# Altium schematic sheet FLAT_LED.SchDoc
size A2
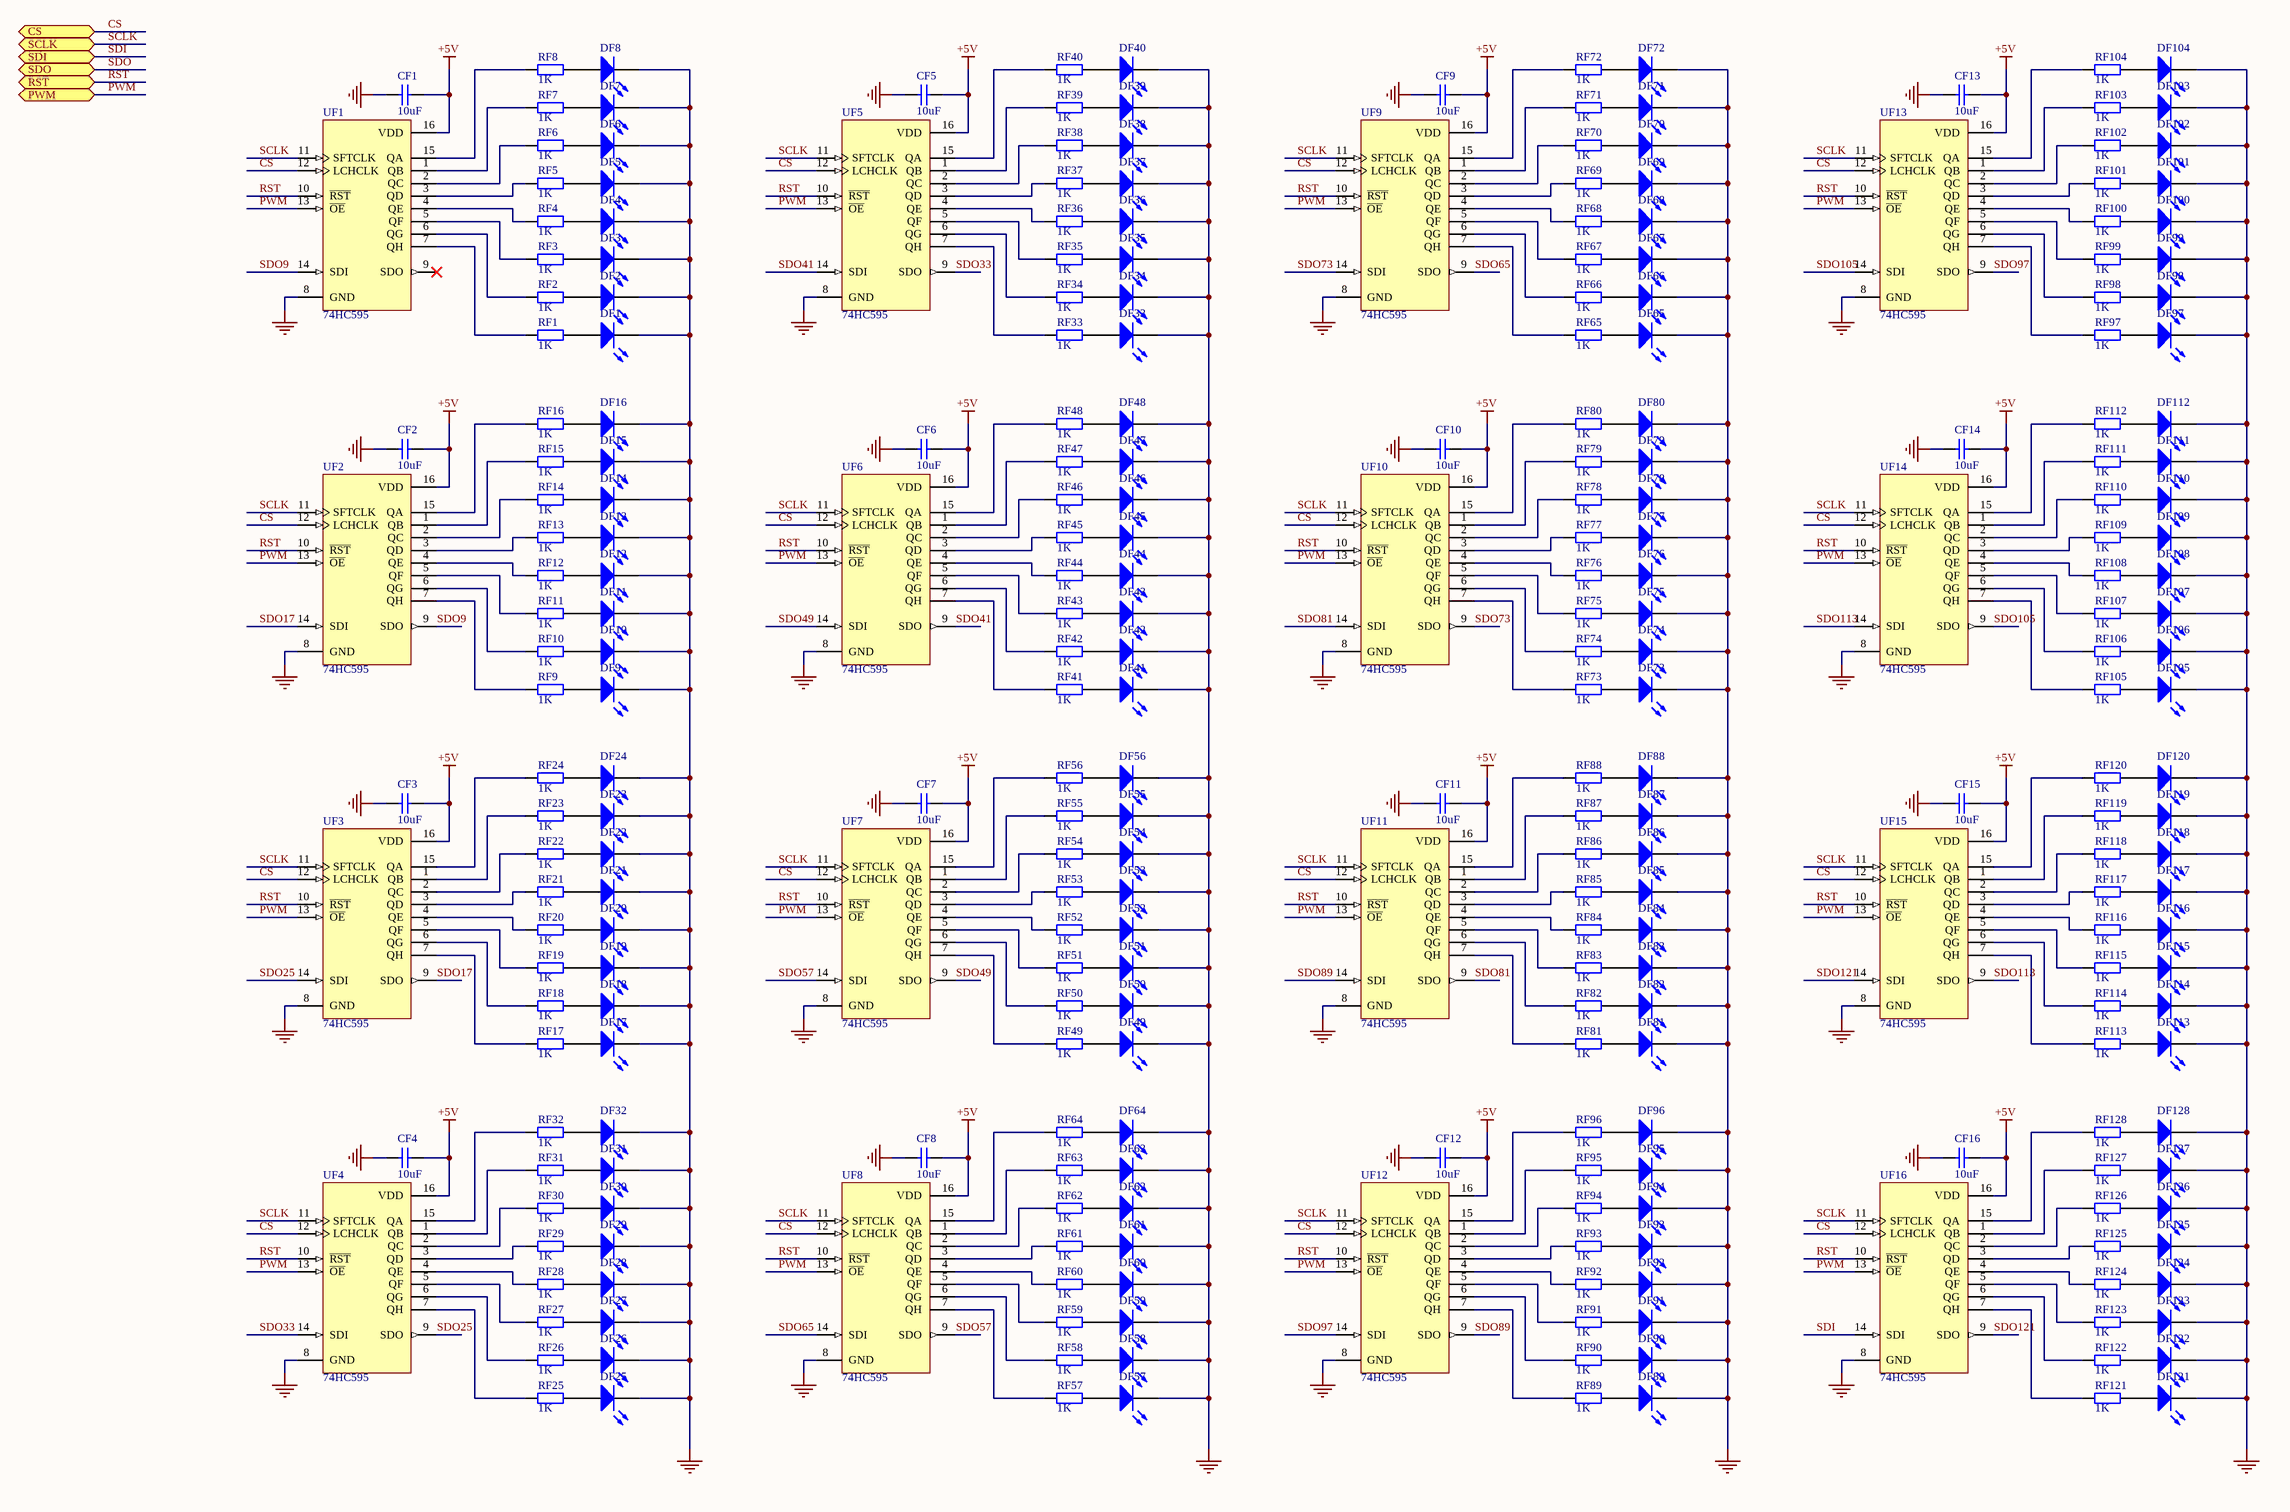
[diagram p0: FLAT_LED.SchDoc]

## Parts
CF1  value 10uF  [CAPC1608N]  (hidden comment: Cap1)
CF2  value 10uF  [CAPC1608N]  (hidden comment: Cap1)
CF3  value 10uF  [CAPC1608N]  (hidden comment: Cap1)
CF4  value 10uF  [CAPC1608N]  (hidden comment: Cap1)
CF5  value 10uF  [CAPC1608N]  (hidden comment: Cap1)
CF6  value 10uF  [CAPC1608N]  (hidden comment: Cap1)
CF7  value 10uF  [CAPC1608N]  (hidden comment: Cap1)
CF8  value 10uF  [CAPC1608N]  (hidden comment: Cap1)
CF9  value 10uF  [CAPC1608N]  (hidden comment: Cap1)
CF10  value 10uF  [CAPC1608N]  (hidden comment: Cap1)
CF11  value 10uF  [CAPC1608N]  (hidden comment: Cap1)
CF12  value 10uF  [CAPC1608N]  (hidden comment: Cap1)
CF13  value 10uF  [CAPC1608N]  (hidden comment: Cap1)
CF14  value 10uF  [CAPC1608N]  (hidden comment: Cap1)
CF15  value 10uF  [CAPC1608N]  (hidden comment: Cap1)
CF16  value 10uF  [CAPC1608N]  (hidden comment: Cap1)
DF1  (no value)  [CD1005-0402-L]
DF2  (no value)  [CD1005-0402-L]
DF3  (no value)  [CD1005-0402-L]
DF4  (no value)  [CD1005-0402-L]
DF5  (no value)  [CD1005-0402-L]
DF6  (no value)  [CD1005-0402-L]
DF7  (no value)  [CD1005-0402-L]
DF8  (no value)  [CD1005-0402-L]
DF9  (no value)  [CD1005-0402-L]
DF10  (no value)  [CD1005-0402-L]
DF11  (no value)  [CD1005-0402-L]
DF12  (no value)  [CD1005-0402-L]
DF13  (no value)  [CD1005-0402-L]
DF14  (no value)  [CD1005-0402-L]
DF15  (no value)  [CD1005-0402-L]
DF16  (no value)  [CD1005-0402-L]
DF17  (no value)  [CD1005-0402-L]
DF18  (no value)  [CD1005-0402-L]
DF19  (no value)  [CD1005-0402-L]
DF20  (no value)  [CD1005-0402-L]
DF21  (no value)  [CD1005-0402-L]
DF22  (no value)  [CD1005-0402-L]
DF23  (no value)  [CD1005-0402-L]
DF24  (no value)  [CD1005-0402-L]
DF25  (no value)  [CD1005-0402-L]
DF26  (no value)  [CD1005-0402-L]
DF27  (no value)  [CD1005-0402-L]
DF28  (no value)  [CD1005-0402-L]
DF29  (no value)  [CD1005-0402-L]
DF30  (no value)  [CD1005-0402-L]
DF31  (no value)  [CD1005-0402-L]
DF32  (no value)  [CD1005-0402-L]
DF33  (no value)  [CD1005-0402-L]
DF34  (no value)  [CD1005-0402-L]
DF35  (no value)  [CD1005-0402-L]
DF36  (no value)  [CD1005-0402-L]
DF37  (no value)  [CD1005-0402-L]
DF38  (no value)  [CD1005-0402-L]
DF39  (no value)  [CD1005-0402-L]
DF40  (no value)  [CD1005-0402-L]
DF41  (no value)  [CD1005-0402-L]
DF42  (no value)  [CD1005-0402-L]
DF43  (no value)  [CD1005-0402-L]
DF44  (no value)  [CD1005-0402-L]
DF45  (no value)  [CD1005-0402-L]
DF46  (no value)  [CD1005-0402-L]
DF47  (no value)  [CD1005-0402-L]
DF48  (no value)  [CD1005-0402-L]
DF49  (no value)  [CD1005-0402-L]
DF50  (no value)  [CD1005-0402-L]
DF51  (no value)  [CD1005-0402-L]
DF52  (no value)  [CD1005-0402-L]
DF53  (no value)  [CD1005-0402-L]
DF54  (no value)  [CD1005-0402-L]
DF55  (no value)  [CD1005-0402-L]
DF56  (no value)  [CD1005-0402-L]
DF57  (no value)  [CD1005-0402-L]
DF58  (no value)  [CD1005-0402-L]
DF59  (no value)  [CD1005-0402-L]
DF60  (no value)  [CD1005-0402-L]
DF61  (no value)  [CD1005-0402-L]
DF62  (no value)  [CD1005-0402-L]
DF63  (no value)  [CD1005-0402-L]
DF64  (no value)  [CD1005-0402-L]
DF65  (no value)  [CD1005-0402-L]
DF66  (no value)  [CD1005-0402-L]
DF67  (no value)  [CD1005-0402-L]
DF68  (no value)  [CD1005-0402-L]
DF69  (no value)  [CD1005-0402-L]
DF70  (no value)  [CD1005-0402-L]
DF71  (no value)  [CD1005-0402-L]
DF72  (no value)  [CD1005-0402-L]
DF73  (no value)  [CD1005-0402-L]
DF74  (no value)  [CD1005-0402-L]
DF75  (no value)  [CD1005-0402-L]
DF76  (no value)  [CD1005-0402-L]
DF77  (no value)  [CD1005-0402-L]
DF78  (no value)  [CD1005-0402-L]
DF79  (no value)  [CD1005-0402-L]
DF80  (no value)  [CD1005-0402-L]
DF81  (no value)  [CD1005-0402-L]
DF82  (no value)  [CD1005-0402-L]
DF83  (no value)  [CD1005-0402-L]
DF84  (no value)  [CD1005-0402-L]
DF85  (no value)  [CD1005-0402-L]
DF86  (no value)  [CD1005-0402-L]
DF87  (no value)  [CD1005-0402-L]
DF88  (no value)  [CD1005-0402-L]
DF89  (no value)  [CD1005-0402-L]
DF90  (no value)  [CD1005-0402-L]
DF91  (no value)  [CD1005-0402-L]
DF92  (no value)  [CD1005-0402-L]
DF93  (no value)  [CD1005-0402-L]
DF94  (no value)  [CD1005-0402-L]
DF95  (no value)  [CD1005-0402-L]
DF96  (no value)  [CD1005-0402-L]
DF97  (no value)  [CD1005-0402-L]
DF98  (no value)  [CD1005-0402-L]
DF99  (no value)  [CD1005-0402-L]
DF100  (no value)  [CD1005-0402-L]
DF101  (no value)  [CD1005-0402-L]
DF102  (no value)  [CD1005-0402-L]
DF103  (no value)  [CD1005-0402-L]
DF104  (no value)  [CD1005-0402-L]
DF105  (no value)  [CD1005-0402-L]
DF106  (no value)  [CD1005-0402-L]
DF107  (no value)  [CD1005-0402-L]
DF108  (no value)  [CD1005-0402-L]
DF109  (no value)  [CD1005-0402-L]
DF110  (no value)  [CD1005-0402-L]
DF111  (no value)  [CD1005-0402-L]
DF112  (no value)  [CD1005-0402-L]
DF113  (no value)  [CD1005-0402-L]
DF114  (no value)  [CD1005-0402-L]
DF115  (no value)  [CD1005-0402-L]
DF116  (no value)  [CD1005-0402-L]
DF117  (no value)  [CD1005-0402-L]
DF118  (no value)  [CD1005-0402-L]
DF119  (no value)  [CD1005-0402-L]
DF120  (no value)  [CD1005-0402-L]
DF121  (no value)  [CD1005-0402-L]
DF122  (no value)  [CD1005-0402-L]
DF123  (no value)  [CD1005-0402-L]
DF124  (no value)  [CD1005-0402-L]
DF125  (no value)  [CD1005-0402-L]
DF126  (no value)  [CD1005-0402-L]
DF127  (no value)  [CD1005-0402-L]
DF128  (no value)  [CD1005-0402-L]
RF1  value 1K  [RESC1005L-0.5]  (hidden comment: Res1)
RF2  value 1K  [RESC1005L-0.5]  (hidden comment: Res1)
RF3  value 1K  [RESC1005L-0.5]  (hidden comment: Res1)
RF4  value 1K  [RESC1005L-0.5]  (hidden comment: Res1)
RF5  value 1K  [RESC1005L-0.5]  (hidden comment: Res1)
RF6  value 1K  [RESC1005L-0.5]  (hidden comment: Res1)
RF7  value 1K  [RESC1005L-0.5]  (hidden comment: Res1)
RF8  value 1K  [RESC1005L-0.5]  (hidden comment: Res1)
RF9  value 1K  [RESC1005L-0.5]  (hidden comment: Res1)
RF10  value 1K  [RESC1005L-0.5]  (hidden comment: Res1)
RF11  value 1K  [RESC1005L-0.5]  (hidden comment: Res1)
RF12  value 1K  [RESC1005L-0.5]  (hidden comment: Res1)
RF13  value 1K  [RESC1005L-0.5]  (hidden comment: Res1)
RF14  value 1K  [RESC1005L-0.5]  (hidden comment: Res1)
RF15  value 1K  [RESC1005L-0.5]  (hidden comment: Res1)
RF16  value 1K  [RESC1005L-0.5]  (hidden comment: Res1)
RF17  value 1K  [RESC1005L-0.5]  (hidden comment: Res1)
RF18  value 1K  [RESC1005L-0.5]  (hidden comment: Res1)
RF19  value 1K  [RESC1005L-0.5]  (hidden comment: Res1)
RF20  value 1K  [RESC1005L-0.5]  (hidden comment: Res1)
RF21  value 1K  [RESC1005L-0.5]  (hidden comment: Res1)
RF22  value 1K  [RESC1005L-0.5]  (hidden comment: Res1)
RF23  value 1K  [RESC1005L-0.5]  (hidden comment: Res1)
RF24  value 1K  [RESC1005L-0.5]  (hidden comment: Res1)
RF25  value 1K  [RESC1005L-0.5]  (hidden comment: Res1)
RF26  value 1K  [RESC1005L-0.5]  (hidden comment: Res1)
RF27  value 1K  [RESC1005L-0.5]  (hidden comment: Res1)
RF28  value 1K  [RESC1005L-0.5]  (hidden comment: Res1)
RF29  value 1K  [RESC1005L-0.5]  (hidden comment: Res1)
RF30  value 1K  [RESC1005L-0.5]  (hidden comment: Res1)
RF31  value 1K  [RESC1005L-0.5]  (hidden comment: Res1)
RF32  value 1K  [RESC1005L-0.5]  (hidden comment: Res1)
RF33  value 1K  [RESC1005L-0.5]  (hidden comment: Res1)
RF34  value 1K  [RESC1005L-0.5]  (hidden comment: Res1)
RF35  value 1K  [RESC1005L-0.5]  (hidden comment: Res1)
RF36  value 1K  [RESC1005L-0.5]  (hidden comment: Res1)
RF37  value 1K  [RESC1005L-0.5]  (hidden comment: Res1)
RF38  value 1K  [RESC1005L-0.5]  (hidden comment: Res1)
RF39  value 1K  [RESC1005L-0.5]  (hidden comment: Res1)
RF40  value 1K  [RESC1005L-0.5]  (hidden comment: Res1)
RF41  value 1K  [RESC1005L-0.5]  (hidden comment: Res1)
RF42  value 1K  [RESC1005L-0.5]  (hidden comment: Res1)
RF43  value 1K  [RESC1005L-0.5]  (hidden comment: Res1)
RF44  value 1K  [RESC1005L-0.5]  (hidden comment: Res1)
RF45  value 1K  [RESC1005L-0.5]  (hidden comment: Res1)
RF46  value 1K  [RESC1005L-0.5]  (hidden comment: Res1)
RF47  value 1K  [RESC1005L-0.5]  (hidden comment: Res1)
RF48  value 1K  [RESC1005L-0.5]  (hidden comment: Res1)
RF49  value 1K  [RESC1005L-0.5]  (hidden comment: Res1)
RF50  value 1K  [RESC1005L-0.5]  (hidden comment: Res1)
RF51  value 1K  [RESC1005L-0.5]  (hidden comment: Res1)
RF52  value 1K  [RESC1005L-0.5]  (hidden comment: Res1)
RF53  value 1K  [RESC1005L-0.5]  (hidden comment: Res1)
RF54  value 1K  [RESC1005L-0.5]  (hidden comment: Res1)
RF55  value 1K  [RESC1005L-0.5]  (hidden comment: Res1)
RF56  value 1K  [RESC1005L-0.5]  (hidden comment: Res1)
RF57  value 1K  [RESC1005L-0.5]  (hidden comment: Res1)
RF58  value 1K  [RESC1005L-0.5]  (hidden comment: Res1)
RF59  value 1K  [RESC1005L-0.5]  (hidden comment: Res1)
RF60  value 1K  [RESC1005L-0.5]  (hidden comment: Res1)
RF61  value 1K  [RESC1005L-0.5]  (hidden comment: Res1)
RF62  value 1K  [RESC1005L-0.5]  (hidden comment: Res1)
RF63  value 1K  [RESC1005L-0.5]  (hidden comment: Res1)
RF64  value 1K  [RESC1005L-0.5]  (hidden comment: Res1)
RF65  value 1K  [RESC1005L-0.5]  (hidden comment: Res1)
RF66  value 1K  [RESC1005L-0.5]  (hidden comment: Res1)
RF67  value 1K  [RESC1005L-0.5]  (hidden comment: Res1)
RF68  value 1K  [RESC1005L-0.5]  (hidden comment: Res1)
RF69  value 1K  [RESC1005L-0.5]  (hidden comment: Res1)
RF70  value 1K  [RESC1005L-0.5]  (hidden comment: Res1)
RF71  value 1K  [RESC1005L-0.5]  (hidden comment: Res1)
RF72  value 1K  [RESC1005L-0.5]  (hidden comment: Res1)
RF73  value 1K  [RESC1005L-0.5]  (hidden comment: Res1)
RF74  value 1K  [RESC1005L-0.5]  (hidden comment: Res1)
RF75  value 1K  [RESC1005L-0.5]  (hidden comment: Res1)
RF76  value 1K  [RESC1005L-0.5]  (hidden comment: Res1)
RF77  value 1K  [RESC1005L-0.5]  (hidden comment: Res1)
RF78  value 1K  [RESC1005L-0.5]  (hidden comment: Res1)
RF79  value 1K  [RESC1005L-0.5]  (hidden comment: Res1)
RF80  value 1K  [RESC1005L-0.5]  (hidden comment: Res1)
RF81  value 1K  [RESC1005L-0.5]  (hidden comment: Res1)
RF82  value 1K  [RESC1005L-0.5]  (hidden comment: Res1)
RF83  value 1K  [RESC1005L-0.5]  (hidden comment: Res1)
RF84  value 1K  [RESC1005L-0.5]  (hidden comment: Res1)
RF85  value 1K  [RESC1005L-0.5]  (hidden comment: Res1)
RF86  value 1K  [RESC1005L-0.5]  (hidden comment: Res1)
RF87  value 1K  [RESC1005L-0.5]  (hidden comment: Res1)
RF88  value 1K  [RESC1005L-0.5]  (hidden comment: Res1)
RF89  value 1K  [RESC1005L-0.5]  (hidden comment: Res1)
RF90  value 1K  [RESC1005L-0.5]  (hidden comment: Res1)
RF91  value 1K  [RESC1005L-0.5]  (hidden comment: Res1)
RF92  value 1K  [RESC1005L-0.5]  (hidden comment: Res1)
RF93  value 1K  [RESC1005L-0.5]  (hidden comment: Res1)
RF94  value 1K  [RESC1005L-0.5]  (hidden comment: Res1)
RF95  value 1K  [RESC1005L-0.5]  (hidden comment: Res1)
RF96  value 1K  [RESC1005L-0.5]  (hidden comment: Res1)
RF97  value 1K  [RESC1005L-0.5]  (hidden comment: Res1)
RF98  value 1K  [RESC1005L-0.5]  (hidden comment: Res1)
RF99  value 1K  [RESC1005L-0.5]  (hidden comment: Res1)
RF100  value 1K  [RESC1005L-0.5]  (hidden comment: Res1)
RF101  value 1K  [RESC1005L-0.5]  (hidden comment: Res1)
RF102  value 1K  [RESC1005L-0.5]  (hidden comment: Res1)
RF103  value 1K  [RESC1005L-0.5]  (hidden comment: Res1)
RF104  value 1K  [RESC1005L-0.5]  (hidden comment: Res1)
RF105  value 1K  [RESC1005L-0.5]  (hidden comment: Res1)
RF106  value 1K  [RESC1005L-0.5]  (hidden comment: Res1)
RF107  value 1K  [RESC1005L-0.5]  (hidden comment: Res1)
RF108  value 1K  [RESC1005L-0.5]  (hidden comment: Res1)
RF109  value 1K  [RESC1005L-0.5]  (hidden comment: Res1)
RF110  value 1K  [RESC1005L-0.5]  (hidden comment: Res1)
RF111  value 1K  [RESC1005L-0.5]  (hidden comment: Res1)
RF112  value 1K  [RESC1005L-0.5]  (hidden comment: Res1)
RF113  value 1K  [RESC1005L-0.5]  (hidden comment: Res1)
RF114  value 1K  [RESC1005L-0.5]  (hidden comment: Res1)
RF115  value 1K  [RESC1005L-0.5]  (hidden comment: Res1)
RF116  value 1K  [RESC1005L-0.5]  (hidden comment: Res1)
RF117  value 1K  [RESC1005L-0.5]  (hidden comment: Res1)
RF118  value 1K  [RESC1005L-0.5]  (hidden comment: Res1)
RF119  value 1K  [RESC1005L-0.5]  (hidden comment: Res1)
RF120  value 1K  [RESC1005L-0.5]  (hidden comment: Res1)
RF121  value 1K  [RESC1005L-0.5]  (hidden comment: Res1)
RF122  value 1K  [RESC1005L-0.5]  (hidden comment: Res1)
RF123  value 1K  [RESC1005L-0.5]  (hidden comment: Res1)
RF124  value 1K  [RESC1005L-0.5]  (hidden comment: Res1)
RF125  value 1K  [RESC1005L-0.5]  (hidden comment: Res1)
RF126  value 1K  [RESC1005L-0.5]  (hidden comment: Res1)
RF127  value 1K  [RESC1005L-0.5]  (hidden comment: Res1)
RF128  value 1K  [RESC1005L-0.5]  (hidden comment: Res1)
UF1  74HC595  [TSSOP-16N]
UF2  74HC595  [TSSOP-16N]
UF3  74HC595  [TSSOP-16N]
UF4  74HC595  [TSSOP-16N]
UF5  74HC595  [TSSOP-16N]
UF6  74HC595  [TSSOP-16N]
UF7  74HC595  [TSSOP-16N]
UF8  74HC595  [TSSOP-16N]
UF9  74HC595  [TSSOP-16N]
UF10  74HC595  [TSSOP-16N]
UF11  74HC595  [TSSOP-16N]
UF12  74HC595  [TSSOP-16N]
UF13  74HC595  [TSSOP-16N]
UF14  74HC595  [TSSOP-16N]
UF15  74HC595  [TSSOP-16N]
UF16  74HC595  [TSSOP-16N]

## Ports
CS, PWM, RST, SCLK, SDI, SDO

## Nets
+5V: CF1.2 CF2.2 CF3.2 CF4.2 CF5.2 CF6.2 CF7.2 CF8.2 CF9.2 CF10.2 CF11.2 CF12.2 CF13.2 CF14.2 CF15.2 CF16.2 UF1.16(VDD) UF2.16(VDD) UF3.16(VDD) UF4.16(VDD) UF5.16(VDD) UF6.16(VDD) UF7.16(VDD) UF8.16(VDD) UF9.16(VDD) UF10.16(VDD) UF11.16(VDD) UF12.16(VDD) UF13.16(VDD) UF14.16(VDD) UF15.16(VDD) UF16.16(VDD)
GND: CF1.1 CF2.1 CF3.1 CF4.1 CF5.1 CF6.1 CF7.1 CF8.1 CF9.1 CF10.1 CF11.1 CF12.1 CF13.1 CF14.1 CF15.1 CF16.1 DF1.2(K) DF2.2(K) DF3.2(K) DF4.2(K) DF5.2(K) DF6.2(K) DF7.2(K) DF8.2(K) DF9.2(K) DF10.2(K) DF11.2(K) DF12.2(K) DF13.2(K) DF14.2(K) DF15.2(K) DF16.2(K) DF17.2(K) DF18.2(K) DF19.2(K) DF20.2(K) DF21.2(K) DF22.2(K) DF23.2(K) DF24.2(K) DF25.2(K) DF26.2(K) DF27.2(K) DF28.2(K) DF29.2(K) DF30.2(K) DF31.2(K) DF32.2(K) DF33.2(K) DF34.2(K) DF35.2(K) DF36.2(K) DF37.2(K) DF38.2(K) DF39.2(K) DF40.2(K) DF41.2(K) DF42.2(K) DF43.2(K) DF44.2(K) DF45.2(K) DF46.2(K) DF47.2(K) DF48.2(K) DF49.2(K) DF50.2(K) DF51.2(K) DF52.2(K) DF53.2(K) DF54.2(K) DF55.2(K) DF56.2(K) DF57.2(K) DF58.2(K) DF59.2(K) DF60.2(K) DF61.2(K) DF62.2(K) DF63.2(K) DF64.2(K) DF65.2(K) DF66.2(K) DF67.2(K) DF68.2(K) DF69.2(K) DF70.2(K) DF71.2(K) DF72.2(K) DF73.2(K) DF74.2(K) DF75.2(K) DF76.2(K) DF77.2(K) DF78.2(K) DF79.2(K) DF80.2(K) DF81.2(K) DF82.2(K) DF83.2(K) DF84.2(K) DF85.2(K) DF86.2(K) DF87.2(K) DF88.2(K) DF89.2(K) DF90.2(K) DF91.2(K) DF92.2(K) DF93.2(K) DF94.2(K) DF95.2(K) DF96.2(K) DF97.2(K) DF98.2(K) DF99.2(K) DF100.2(K) DF101.2(K) DF102.2(K) DF103.2(K) DF104.2(K) DF105.2(K) DF106.2(K) DF107.2(K) DF108.2(K) DF109.2(K) DF110.2(K) DF111.2(K) DF112.2(K) DF113.2(K) DF114.2(K) DF115.2(K) DF116.2(K) DF117.2(K) DF118.2(K) DF119.2(K) DF120.2(K) DF121.2(K) DF122.2(K) DF123.2(K) DF124.2(K) DF125.2(K) DF126.2(K) DF127.2(K) DF128.2(K) UF1.8(GND) UF2.8(GND) UF3.8(GND) UF4.8(GND) UF5.8(GND) UF6.8(GND) UF7.8(GND) UF8.8(GND) UF9.8(GND) UF10.8(GND) UF11.8(GND) UF12.8(GND) UF13.8(GND) UF14.8(GND) UF15.8(GND) UF16.8(GND)
CS: UF1.12(LCHCLK) UF2.12(LCHCLK) UF3.12(LCHCLK) UF4.12(LCHCLK) UF5.12(LCHCLK) UF6.12(LCHCLK) UF7.12(LCHCLK) UF8.12(LCHCLK) UF9.12(LCHCLK) UF10.12(LCHCLK) UF11.12(LCHCLK) UF12.12(LCHCLK) UF13.12(LCHCLK) UF14.12(LCHCLK) UF15.12(LCHCLK) UF16.12(LCHCLK) ; port CS
PWM: UF1.13(~{OE}) UF2.13(~{OE}) UF3.13(~{OE}) UF4.13(~{OE}) UF5.13(~{OE}) UF6.13(~{OE}) UF7.13(~{OE}) UF8.13(~{OE}) UF9.13(~{OE}) UF10.13(~{OE}) UF11.13(~{OE}) UF12.13(~{OE}) UF13.13(~{OE}) UF14.13(~{OE}) UF15.13(~{OE}) UF16.13(~{OE}) ; port PWM
RST: UF1.10(~{RST}) UF2.10(~{RST}) UF3.10(~{RST}) UF4.10(~{RST}) UF5.10(~{RST}) UF6.10(~{RST}) UF7.10(~{RST}) UF8.10(~{RST}) UF9.10(~{RST}) UF10.10(~{RST}) UF11.10(~{RST}) UF12.10(~{RST}) UF13.10(~{RST}) UF14.10(~{RST}) UF15.10(~{RST}) UF16.10(~{RST}) ; port RST
SCLK: UF1.11(SFTCLK) UF2.11(SFTCLK) UF3.11(SFTCLK) UF4.11(SFTCLK) UF5.11(SFTCLK) UF6.11(SFTCLK) UF7.11(SFTCLK) UF8.11(SFTCLK) UF9.11(SFTCLK) UF10.11(SFTCLK) UF11.11(SFTCLK) UF12.11(SFTCLK) UF13.11(SFTCLK) UF14.11(SFTCLK) UF15.11(SFTCLK) UF16.11(SFTCLK) ; port SCLK
SDI: UF16.14(SDI) ; port SDI
SDO: port SDO
SDO9: UF1.14(SDI) UF2.9(SDO)
SDO17: UF2.14(SDI) UF3.9(SDO)
SDO25: UF3.14(SDI) UF4.9(SDO)
SDO33: UF4.14(SDI) UF5.9(SDO)
SDO41: UF5.14(SDI) UF6.9(SDO)
SDO49: UF6.14(SDI) UF7.9(SDO)
SDO57: UF7.14(SDI) UF8.9(SDO)
SDO65: UF8.14(SDI) UF9.9(SDO)
SDO73: UF9.14(SDI) UF10.9(SDO)
SDO81: UF10.14(SDI) UF11.9(SDO)
SDO89: UF11.14(SDI) UF12.9(SDO)
SDO97: UF12.14(SDI) UF13.9(SDO)
SDO105: UF13.14(SDI) UF14.9(SDO)
SDO113: UF14.14(SDI) UF15.9(SDO)
SDO121: UF15.14(SDI) UF16.9(SDO)
NetDF1_1: DF1.1(A) RF1.2
NetDF2_1: DF2.1(A) RF2.2
NetDF3_1: DF3.1(A) RF3.2
NetDF4_1: DF4.1(A) RF4.2
NetDF5_1: DF5.1(A) RF5.2
NetDF6_1: DF6.1(A) RF6.2
NetDF7_1: DF7.1(A) RF7.2
NetDF8_1: DF8.1(A) RF8.2
NetDF9_1: DF9.1(A) RF9.2
NetDF10_1: DF10.1(A) RF10.2
NetDF11_1: DF11.1(A) RF11.2
NetDF12_1: DF12.1(A) RF12.2
NetDF13_1: DF13.1(A) RF13.2
NetDF14_1: DF14.1(A) RF14.2
NetDF15_1: DF15.1(A) RF15.2
NetDF16_1: DF16.1(A) RF16.2
NetDF17_1: DF17.1(A) RF17.2
NetDF18_1: DF18.1(A) RF18.2
NetDF19_1: DF19.1(A) RF19.2
NetDF20_1: DF20.1(A) RF20.2
NetDF21_1: DF21.1(A) RF21.2
NetDF22_1: DF22.1(A) RF22.2
NetDF23_1: DF23.1(A) RF23.2
NetDF24_1: DF24.1(A) RF24.2
NetDF25_1: DF25.1(A) RF25.2
NetDF26_1: DF26.1(A) RF26.2
NetDF27_1: DF27.1(A) RF27.2
NetDF28_1: DF28.1(A) RF28.2
NetDF29_1: DF29.1(A) RF29.2
NetDF30_1: DF30.1(A) RF30.2
NetDF31_1: DF31.1(A) RF31.2
NetDF32_1: DF32.1(A) RF32.2
NetDF33_1: DF33.1(A) RF33.2
NetDF34_1: DF34.1(A) RF34.2
NetDF35_1: DF35.1(A) RF35.2
NetDF36_1: DF36.1(A) RF36.2
NetDF37_1: DF37.1(A) RF37.2
NetDF38_1: DF38.1(A) RF38.2
NetDF39_1: DF39.1(A) RF39.2
NetDF40_1: DF40.1(A) RF40.2
NetDF41_1: DF41.1(A) RF41.2
NetDF42_1: DF42.1(A) RF42.2
NetDF43_1: DF43.1(A) RF43.2
NetDF44_1: DF44.1(A) RF44.2
NetDF45_1: DF45.1(A) RF45.2
NetDF46_1: DF46.1(A) RF46.2
NetDF47_1: DF47.1(A) RF47.2
NetDF48_1: DF48.1(A) RF48.2
NetDF49_1: DF49.1(A) RF49.2
NetDF50_1: DF50.1(A) RF50.2
NetDF51_1: DF51.1(A) RF51.2
NetDF52_1: DF52.1(A) RF52.2
NetDF53_1: DF53.1(A) RF53.2
NetDF54_1: DF54.1(A) RF54.2
NetDF55_1: DF55.1(A) RF55.2
NetDF56_1: DF56.1(A) RF56.2
NetDF57_1: DF57.1(A) RF57.2
NetDF58_1: DF58.1(A) RF58.2
NetDF59_1: DF59.1(A) RF59.2
NetDF60_1: DF60.1(A) RF60.2
NetDF61_1: DF61.1(A) RF61.2
NetDF62_1: DF62.1(A) RF62.2
NetDF63_1: DF63.1(A) RF63.2
NetDF64_1: DF64.1(A) RF64.2
NetDF65_1: DF65.1(A) RF65.2
NetDF66_1: DF66.1(A) RF66.2
NetDF67_1: DF67.1(A) RF67.2
NetDF68_1: DF68.1(A) RF68.2
NetDF69_1: DF69.1(A) RF69.2
NetDF70_1: DF70.1(A) RF70.2
NetDF71_1: DF71.1(A) RF71.2
NetDF72_1: DF72.1(A) RF72.2
NetDF73_1: DF73.1(A) RF73.2
NetDF74_1: DF74.1(A) RF74.2
NetDF75_1: DF75.1(A) RF75.2
NetDF76_1: DF76.1(A) RF76.2
NetDF77_1: DF77.1(A) RF77.2
NetDF78_1: DF78.1(A) RF78.2
NetDF79_1: DF79.1(A) RF79.2
NetDF80_1: DF80.1(A) RF80.2
NetDF81_1: DF81.1(A) RF81.2
NetDF82_1: DF82.1(A) RF82.2
NetDF83_1: DF83.1(A) RF83.2
NetDF84_1: DF84.1(A) RF84.2
NetDF85_1: DF85.1(A) RF85.2
NetDF86_1: DF86.1(A) RF86.2
NetDF87_1: DF87.1(A) RF87.2
NetDF88_1: DF88.1(A) RF88.2
NetDF89_1: DF89.1(A) RF89.2
NetDF90_1: DF90.1(A) RF90.2
NetDF91_1: DF91.1(A) RF91.2
NetDF92_1: DF92.1(A) RF92.2
NetDF93_1: DF93.1(A) RF93.2
NetDF94_1: DF94.1(A) RF94.2
NetDF95_1: DF95.1(A) RF95.2
NetDF96_1: DF96.1(A) RF96.2
NetDF97_1: DF97.1(A) RF97.2
NetDF98_1: DF98.1(A) RF98.2
NetDF99_1: DF99.1(A) RF99.2
NetDF100_1: DF100.1(A) RF100.2
NetDF101_1: DF101.1(A) RF101.2
NetDF102_1: DF102.1(A) RF102.2
NetDF103_1: DF103.1(A) RF103.2
NetDF104_1: DF104.1(A) RF104.2
NetDF105_1: DF105.1(A) RF105.2
NetDF106_1: DF106.1(A) RF106.2
NetDF107_1: DF107.1(A) RF107.2
NetDF108_1: DF108.1(A) RF108.2
NetDF109_1: DF109.1(A) RF109.2
NetDF110_1: DF110.1(A) RF110.2
NetDF111_1: DF111.1(A) RF111.2
NetDF112_1: DF112.1(A) RF112.2
NetDF113_1: DF113.1(A) RF113.2
NetDF114_1: DF114.1(A) RF114.2
NetDF115_1: DF115.1(A) RF115.2
NetDF116_1: DF116.1(A) RF116.2
NetDF117_1: DF117.1(A) RF117.2
NetDF118_1: DF118.1(A) RF118.2
NetDF119_1: DF119.1(A) RF119.2
NetDF120_1: DF120.1(A) RF120.2
NetDF121_1: DF121.1(A) RF121.2
NetDF122_1: DF122.1(A) RF122.2
NetDF123_1: DF123.1(A) RF123.2
NetDF124_1: DF124.1(A) RF124.2
NetDF125_1: DF125.1(A) RF125.2
NetDF126_1: DF126.1(A) RF126.2
NetDF127_1: DF127.1(A) RF127.2
NetDF128_1: DF128.1(A) RF128.2
NetRF1_1: RF1.1 UF1.7(QH)
NetRF2_1: RF2.1 UF1.6(QG)
NetRF3_1: RF3.1 UF1.5(QF)
NetRF4_1: RF4.1 UF1.4(QE)
NetRF5_1: RF5.1 UF1.3(QD)
NetRF6_1: RF6.1 UF1.2(QC)
NetRF7_1: RF7.1 UF1.1(QB)
NetRF8_1: RF8.1 UF1.15(QA)
NetRF9_1: RF9.1 UF2.7(QH)
NetRF10_1: RF10.1 UF2.6(QG)
NetRF11_1: RF11.1 UF2.5(QF)
NetRF12_1: RF12.1 UF2.4(QE)
NetRF13_1: RF13.1 UF2.3(QD)
NetRF14_1: RF14.1 UF2.2(QC)
NetRF15_1: RF15.1 UF2.1(QB)
NetRF16_1: RF16.1 UF2.15(QA)
NetRF17_1: RF17.1 UF3.7(QH)
NetRF18_1: RF18.1 UF3.6(QG)
NetRF19_1: RF19.1 UF3.5(QF)
NetRF20_1: RF20.1 UF3.4(QE)
NetRF21_1: RF21.1 UF3.3(QD)
NetRF22_1: RF22.1 UF3.2(QC)
NetRF23_1: RF23.1 UF3.1(QB)
NetRF24_1: RF24.1 UF3.15(QA)
NetRF25_1: RF25.1 UF4.7(QH)
NetRF26_1: RF26.1 UF4.6(QG)
NetRF27_1: RF27.1 UF4.5(QF)
NetRF28_1: RF28.1 UF4.4(QE)
NetRF29_1: RF29.1 UF4.3(QD)
NetRF30_1: RF30.1 UF4.2(QC)
NetRF31_1: RF31.1 UF4.1(QB)
NetRF32_1: RF32.1 UF4.15(QA)
NetRF33_1: RF33.1 UF5.7(QH)
NetRF34_1: RF34.1 UF5.6(QG)
NetRF35_1: RF35.1 UF5.5(QF)
NetRF36_1: RF36.1 UF5.4(QE)
NetRF37_1: RF37.1 UF5.3(QD)
NetRF38_1: RF38.1 UF5.2(QC)
NetRF39_1: RF39.1 UF5.1(QB)
NetRF40_1: RF40.1 UF5.15(QA)
NetRF41_1: RF41.1 UF6.7(QH)
NetRF42_1: RF42.1 UF6.6(QG)
NetRF43_1: RF43.1 UF6.5(QF)
NetRF44_1: RF44.1 UF6.4(QE)
NetRF45_1: RF45.1 UF6.3(QD)
NetRF46_1: RF46.1 UF6.2(QC)
NetRF47_1: RF47.1 UF6.1(QB)
NetRF48_1: RF48.1 UF6.15(QA)
NetRF49_1: RF49.1 UF7.7(QH)
NetRF50_1: RF50.1 UF7.6(QG)
NetRF51_1: RF51.1 UF7.5(QF)
NetRF52_1: RF52.1 UF7.4(QE)
NetRF53_1: RF53.1 UF7.3(QD)
NetRF54_1: RF54.1 UF7.2(QC)
NetRF55_1: RF55.1 UF7.1(QB)
NetRF56_1: RF56.1 UF7.15(QA)
NetRF57_1: RF57.1 UF8.7(QH)
NetRF58_1: RF58.1 UF8.6(QG)
NetRF59_1: RF59.1 UF8.5(QF)
NetRF60_1: RF60.1 UF8.4(QE)
NetRF61_1: RF61.1 UF8.3(QD)
NetRF62_1: RF62.1 UF8.2(QC)
NetRF63_1: RF63.1 UF8.1(QB)
NetRF64_1: RF64.1 UF8.15(QA)
NetRF65_1: RF65.1 UF9.7(QH)
NetRF66_1: RF66.1 UF9.6(QG)
NetRF67_1: RF67.1 UF9.5(QF)
NetRF68_1: RF68.1 UF9.4(QE)
NetRF69_1: RF69.1 UF9.3(QD)
NetRF70_1: RF70.1 UF9.2(QC)
NetRF71_1: RF71.1 UF9.1(QB)
NetRF72_1: RF72.1 UF9.15(QA)
NetRF73_1: RF73.1 UF10.7(QH)
NetRF74_1: RF74.1 UF10.6(QG)
NetRF75_1: RF75.1 UF10.5(QF)
NetRF76_1: RF76.1 UF10.4(QE)
NetRF77_1: RF77.1 UF10.3(QD)
NetRF78_1: RF78.1 UF10.2(QC)
NetRF79_1: RF79.1 UF10.1(QB)
NetRF80_1: RF80.1 UF10.15(QA)
NetRF81_1: RF81.1 UF11.7(QH)
NetRF82_1: RF82.1 UF11.6(QG)
NetRF83_1: RF83.1 UF11.5(QF)
NetRF84_1: RF84.1 UF11.4(QE)
NetRF85_1: RF85.1 UF11.3(QD)
NetRF86_1: RF86.1 UF11.2(QC)
NetRF87_1: RF87.1 UF11.1(QB)
NetRF88_1: RF88.1 UF11.15(QA)
NetRF89_1: RF89.1 UF12.7(QH)
NetRF90_1: RF90.1 UF12.6(QG)
NetRF91_1: RF91.1 UF12.5(QF)
NetRF92_1: RF92.1 UF12.4(QE)
NetRF93_1: RF93.1 UF12.3(QD)
NetRF94_1: RF94.1 UF12.2(QC)
NetRF95_1: RF95.1 UF12.1(QB)
NetRF96_1: RF96.1 UF12.15(QA)
NetRF97_1: RF97.1 UF13.7(QH)
NetRF98_1: RF98.1 UF13.6(QG)
NetRF99_1: RF99.1 UF13.5(QF)
NetRF100_1: RF100.1 UF13.4(QE)
NetRF101_1: RF101.1 UF13.3(QD)
NetRF102_1: RF102.1 UF13.2(QC)
NetRF103_1: RF103.1 UF13.1(QB)
NetRF104_1: RF104.1 UF13.15(QA)
NetRF105_1: RF105.1 UF14.7(QH)
NetRF106_1: RF106.1 UF14.6(QG)
NetRF107_1: RF107.1 UF14.5(QF)
NetRF108_1: RF108.1 UF14.4(QE)
NetRF109_1: RF109.1 UF14.3(QD)
NetRF110_1: RF110.1 UF14.2(QC)
NetRF111_1: RF111.1 UF14.1(QB)
NetRF112_1: RF112.1 UF14.15(QA)
NetRF113_1: RF113.1 UF15.7(QH)
NetRF114_1: RF114.1 UF15.6(QG)
NetRF115_1: RF115.1 UF15.5(QF)
NetRF116_1: RF116.1 UF15.4(QE)
NetRF117_1: RF117.1 UF15.3(QD)
NetRF118_1: RF118.1 UF15.2(QC)
NetRF119_1: RF119.1 UF15.1(QB)
NetRF120_1: RF120.1 UF15.15(QA)
NetRF121_1: RF121.1 UF16.7(QH)
NetRF122_1: RF122.1 UF16.6(QG)
NetRF123_1: RF123.1 UF16.5(QF)
NetRF124_1: RF124.1 UF16.4(QE)
NetRF125_1: RF125.1 UF16.3(QD)
NetRF126_1: RF126.1 UF16.2(QC)
NetRF127_1: RF127.1 UF16.1(QB)
NetRF128_1: RF128.1 UF16.15(QA)

Not connected (* = marked no-connect by the designer): UF1 9(SDO)*

## Library data of the parts
CF1-CF16 = Cap1: Capacitor; Published: 8-Jun-2000; LatestRevisionDate: 17-Jul-2002; LatestRevisionNote: Re-released for DXP Platform.; PackageReference: RAD-0.3; Publisher: Altium Limited
DF1-DF128 = LED2: Typical RED, GREEN, YELLOW, AMBER GaAs LED; Published: 8-Jun-2000; LatestRevisionDate: 17-Jul-2002; LatestRevisionNote: Re-released for DXP Platform.; PackageVersion: Feb-2002; PackageReference: 3.2X1.6X1.1; Publisher: Altium Limited; PackageDescription: SM LED; 2 Flat Leads
RF1-RF128 = Res1: Resistor; Published: 8-Jun-2000; LatestRevisionDate: 17-Jul-2002; LatestRevisionNote: Re-released for DXP Platform.; PackageReference: AXIAL-0.4; Publisher: Altium Limited
UF1-UF16 = 74HC595: 8-Bit Serial-Input/Serial or Prallel-Output Shift Register with Latched 3-State Outputs; Published: 15-Apr-2002; LatestRevisionDate: 12-Dec-2006; LatestRevisionNote: IPC-7351 Footprint Added.; DatasheetVersion: Mar-2000; PackageVersion: Feb-2000; PackageReference: 948F-01; Publisher: Altium Limited; PackageDescription: 16-Pin Thin Small Outline Package 0.65 mm Pitch; ComponentLink1Description: Manufacturer Link; ComponentLink1URL: http://www.onsemi.com/; ComponentLink2Description: Datasheet; ComponentLink2URL: http://www.onsemi.com/pub/Collateral/MC74HC595A-D.PDF